# EAGLE design Main (EAGLE 7.6.0)
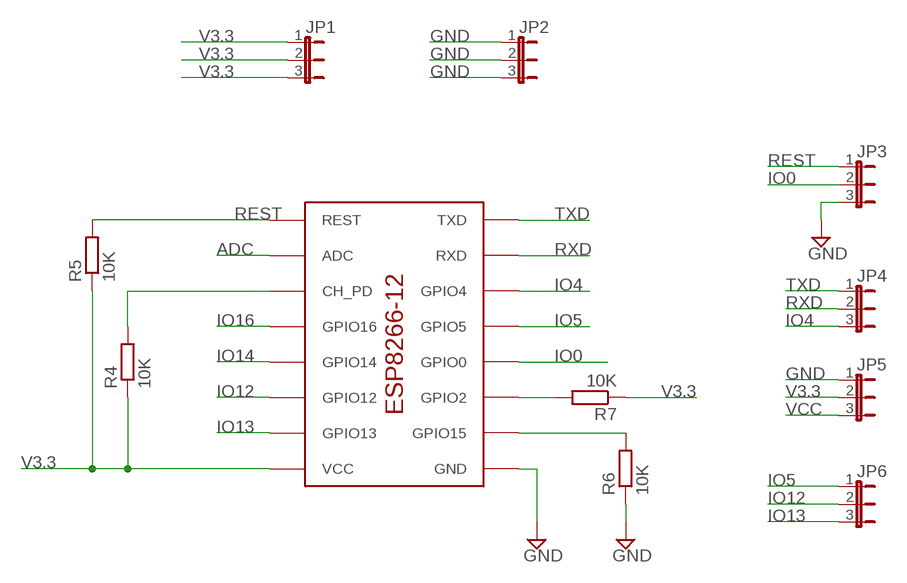
[diagram p0: schematic, sheet 1]

## Parts
JP1  JP2E  [JP2]
JP2  JP2E  [JP2]
JP3  JP2E  [JP2]
JP4  JP2E  [JP2]
JP5  JP2E  [JP2]
JP6  JP2E  [JP2]
R4  10K  R-EU_M0805  [M0805]
R5  10K  R-EU_M0805  [M0805]
R6  10K  R-EU_M0805  [M0805]
R7  10K  R-EU_M0805  [M0805]
U$1  ESP8266-12  [ESP8266-12]

## Nets
ADC: U$1.ADC
GND [PWR]: JP2.1 JP2.2 JP2.3 JP3.3 JP5.1 R6.1 U$1.GND
IO0: JP3.2 U$1.GPIO0
IO4: JP4.3 U$1.GPIO4
IO5: JP6.1 U$1.GPIO5
IO12: JP6.2 U$1.GPIO12
IO13: JP6.3 U$1.GPIO13
IO14: U$1.GPIO14
IO16: U$1.GPIO16
N$7: R4.2 U$1.CH_PD
N$9: R6.2 U$1.GPIO15
N$10: R7.2 U$1.GPIO2
REST: JP3.1 R5.2 U$1.REST
RXD: JP4.2 U$1.RXD
TXD: JP4.1 U$1.TXD
V3.3 [PWR]: JP1.1 JP1.2 JP1.3 JP5.2 R4.1 R5.1 R7.1 U$1.VCC
VCC [PWR]: JP5.3

## Library data of the parts
JP1-JP6 = jumper:JP2E: JUMPER
R4-R7 = resistor:R-EU_: RESISTOR, European symbol
U$1 = captain-slow:ESP8266-12

## Net classes
1 230V: width 1.27 mm, clearance 2.54 mm
2 PWR: width 0.635 mm, clearance 1.27 mm

## Board
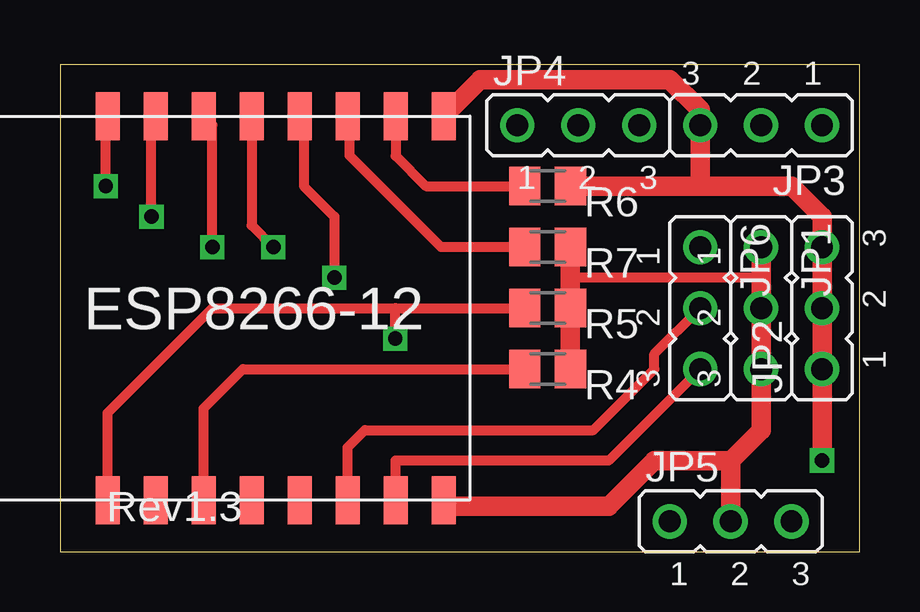
[diagram p1: board, top side]
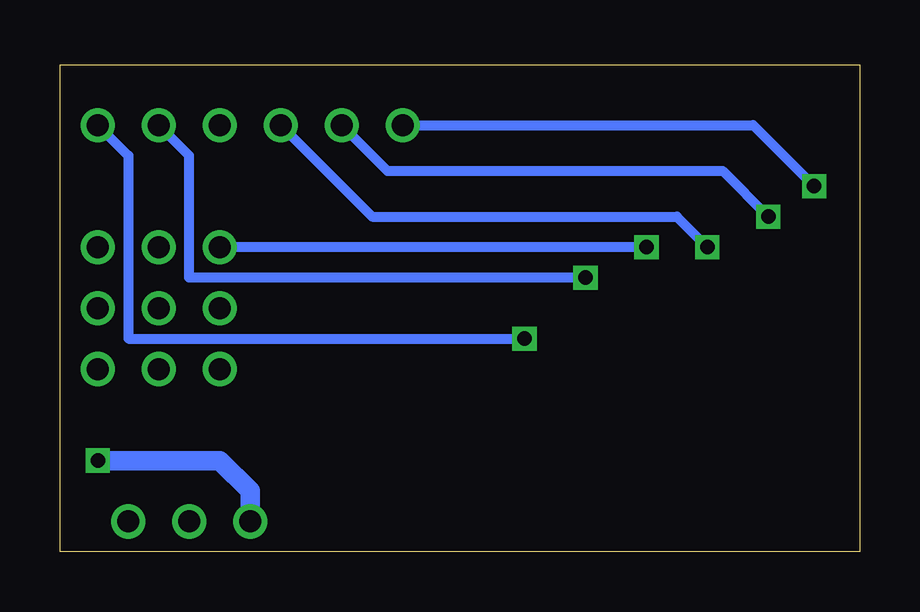
[diagram p2: board, bottom side, seen from below]

Size 33.33 x 20.31 mm. Coordinates in mm from the lower left corner, seen from the top.
Outline: 0,0 33.33,0 33.33,20.31 0,20.31 0,0
Copper layers (1*16): Top 0.035mm / dielectric 1.5mm / Bottom 0.035mm
Design rules "default": minimum track width 10mil, minimum drill 24mil, track to track 8mil, track to pad 8mil, pad to pad 8mil, via to via 8mil, smd to smd 8mil, copper to edge 40mil, drill to drill 8mil, minimum pad ring 10mil, minimum via ring 8mil, stop-mask expansion 4mil, vias tented up to drill 0mil, thermal gap 10mil

### Footprints (pad centres in the part's own frame; a part is rotated, then mirrored left to right if it is on the bottom)
JP2 = drill 0.914: 1 -2.54,0; 2 0,0; 3 2.54,0
M0805 = smd 1.3 x 1.6: 1 -0.95,0; 2 0.95,0
ESP8266-12 = smd 2 x 1: ADC -8,1.1; CH_PD -8,-0.9; GND 8,-10.9; GPIO0 8,-4.9; GPIO2 8,-6.9; GPIO4 8,-0.9; GPIO5 8,-2.9; GPIO12 -8,-6.9; GPIO13 -8,-8.9; GPIO14 -8,-4.9; GPIO15 8,-8.9; GPIO16 -8,-2.9; REST -8,3.1; RXD 8,1.1; TXD 8,3.1; VCC -8,-10.9

### Placement (x,y rotation side)
JP1  29.21,10.16 270 top
JP2  31.75,10.16 90 top
JP3  29.21,17.78 180 top
JP4  21.59,17.78 0 top
JP5  27.94,1.27 0 top
JP6  26.67,10.16 270 top
R4  20.32,7.62 180 top
R5  20.32,10.16 180 top
R6  20.32,15.24 180 top
R7  20.32,12.7 180 top
U$1  5.08,10.16 90 top

### Tracks (layer width: path | path; a pad name or v marks a point on that pad's centre or on a via)
GND  (via drill 0.6)
  Top 0.813: U$1.GND 17.5,19.68 25.4,19.68 26.67,18.41 JP3.3 26.67,15.24 | 26.67,15.24 R6.1 | v31.75,3.81 JP2.1 JP2.2 JP2.3 31.75,13.97 30.48,15.24 26.67,15.24
  Bottom 0.813: JP5.1 25.4,2.54 26.67,3.81 v31.75,3.81
  other vias: 26.67,17.78
IO0  (via drill 0.6)
  Top 0.406: U$1.GPIO0 10.16,17.98 10.16,15.24 11.43,13.97 v11.43,11.43
  Bottom 0.406: v11.43,11.43 27.94,11.43 27.94,16.51 JP3.2
IO4  (via drill 0.6)
  Top 0.406: v6.35,12.7 6.35,17.79 U$1.GPIO4
  Bottom 0.406: JP4.3 20.32,13.97 7.62,13.97 v6.35,12.7
IO5  (via drill 0.6)
  Top 0.406: U$1.GPIO5 7.98,13.61 v8.89,12.7
  Bottom 0.406: v8.89,12.7 JP6.1
IO12
  Top 0.406: U$1.GPIO12 11.98,4.36 12.7,5.08 22.23,5.08 24.77,7.62 24.77,8.26 JP6.2
IO13
  Top 0.406: JP6.3 22.86,3.81 13.97,3.81 U$1.GPIO13
N$7
  Top 0.406: U$1.CH_PD 5.98,5.98 7.62,7.62 R4.2
N$9
  Top 0.406: U$1.GPIO15 13.98,16.5 15.24,15.24 R6.2
N$10
  Top 0.406: R7.2 15.88,12.7 12.06,16.51 12.06,18.07 U$1.GPIO2
REST  (via drill 0.6)
  Top 0.406: U$1.REST 1.98,5.79 6.35,10.16 13.97,10.16 | 13.97,10.16 R5.2 | v13.97,8.89 13.97,10.16
  Bottom 0.406: JP3.1 30.48,16.51 30.48,8.89 v13.97,8.89
RXD  (via drill 0.6)
  Top 0.406: v3.81,13.97 3.81,17.99 U$1.RXD
  Bottom 0.406: JP4.2 19.68,15.88 5.71,15.88 v3.81,13.97
TXD  (via drill 0.6)
  Top 0.406: v1.91,15.24 1.91,18.09 U$1.TXD
  Bottom 0.406: JP4.1 4.45,17.78 v1.91,15.24
V3.3
  Top 0.406: R5.1 R4.1 | 21.27,9.84 21.59,10.16 | U$1.VCC 16.36,1.91 | 29.21,11.43 21.27,11.43
  Top 0.813: R7.1 21.27,11.43 R5.1 | R4.1 21.27,9.84 | JP5.2 27.94,3.81 | 27.94,3.81 29.21,5.08 JP1.3 JP1.2 | JP1.2 29.21,11.43 JP1.1 JP1.2 | 16.36,1.91 22.86,1.91 24.77,3.81 27.94,3.81

### Text on the board
tNames: Rev1.3